# EAGLE board cbm2-8088 (EAGLE 5.11), part 1 of 2
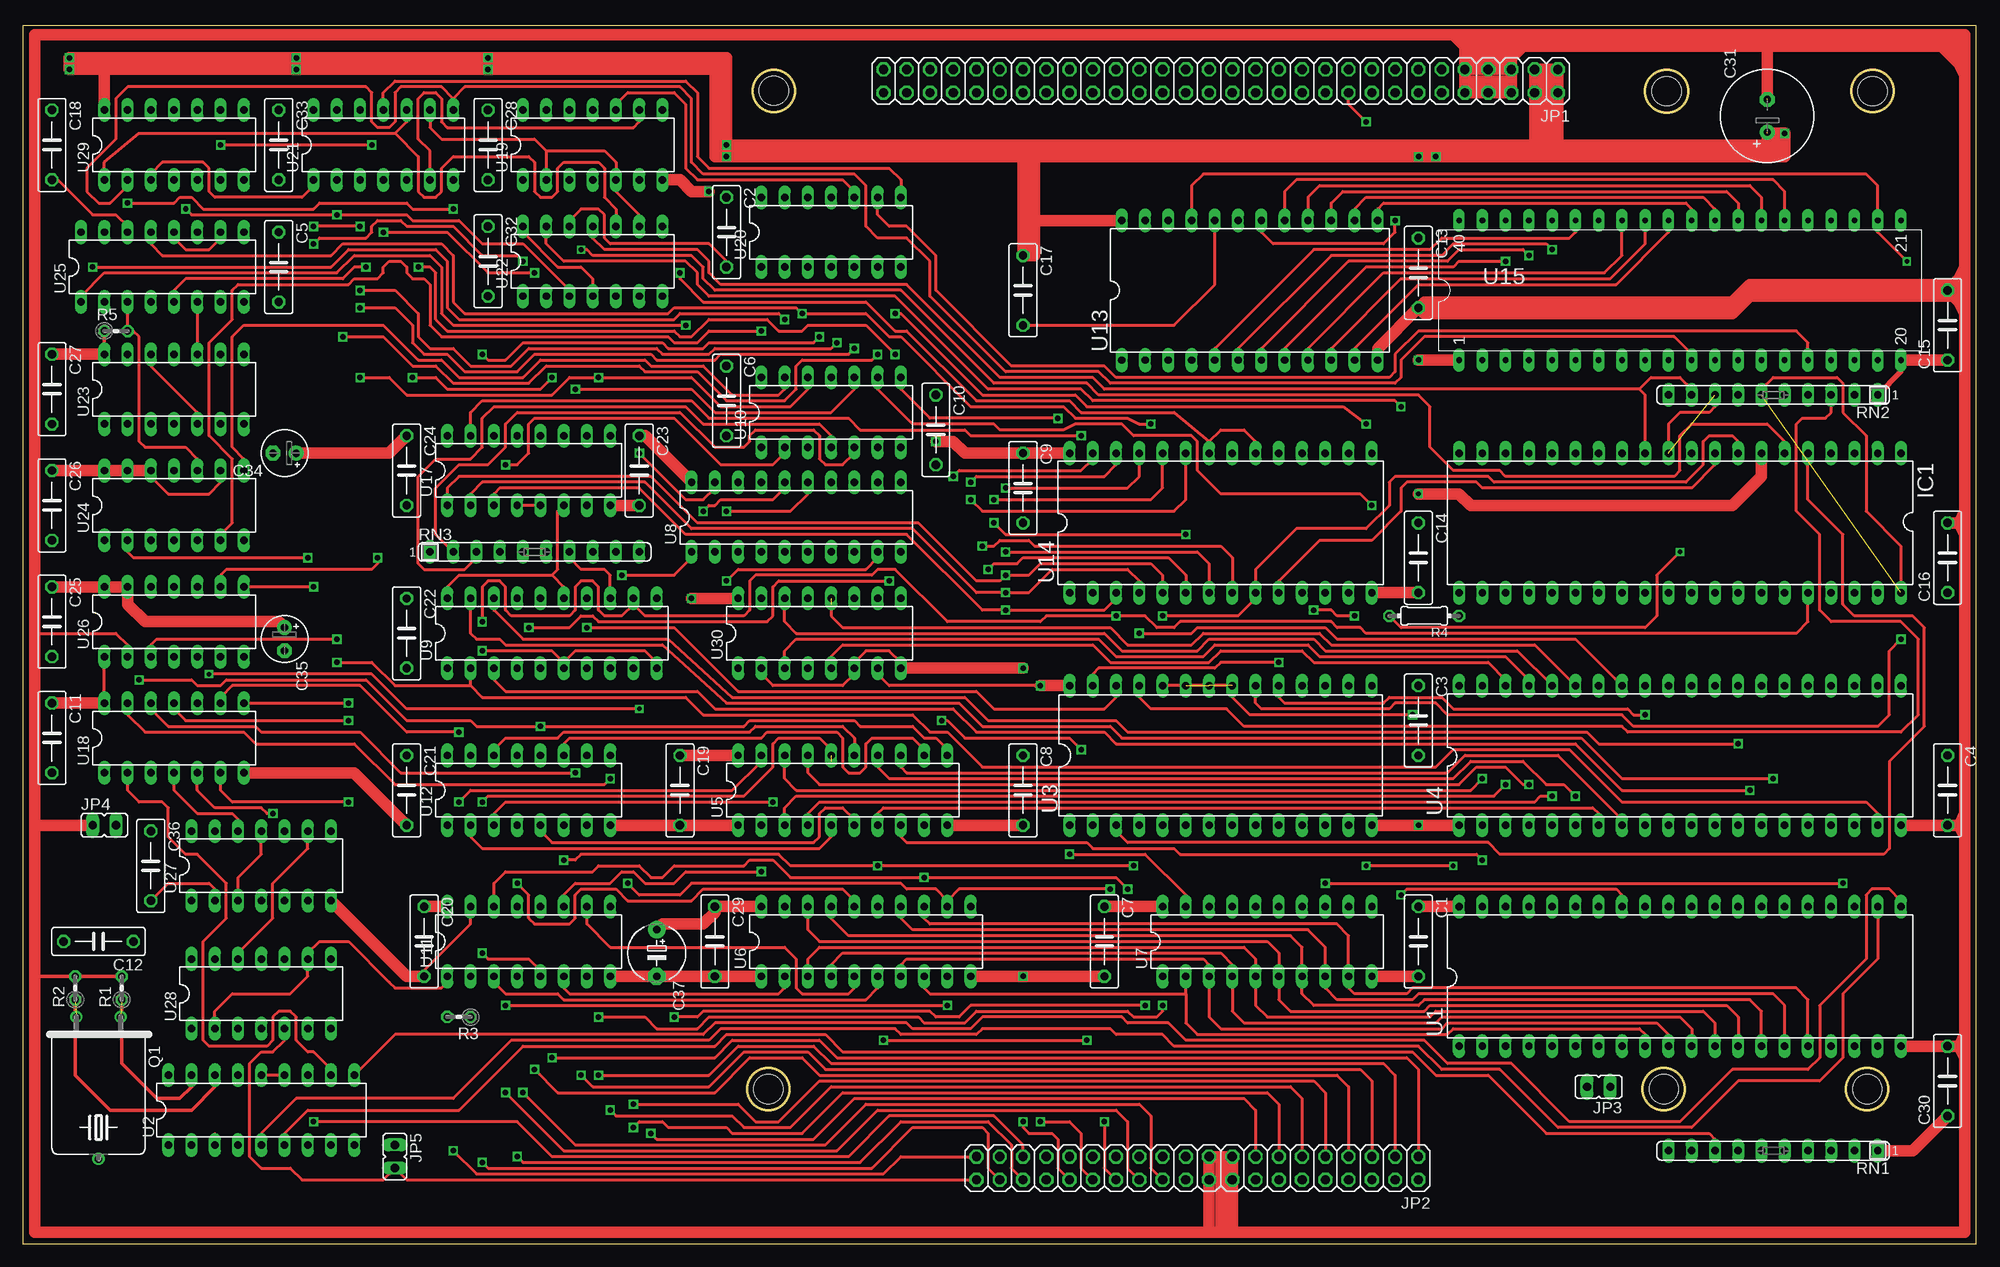
[diagram p2: board, top side]
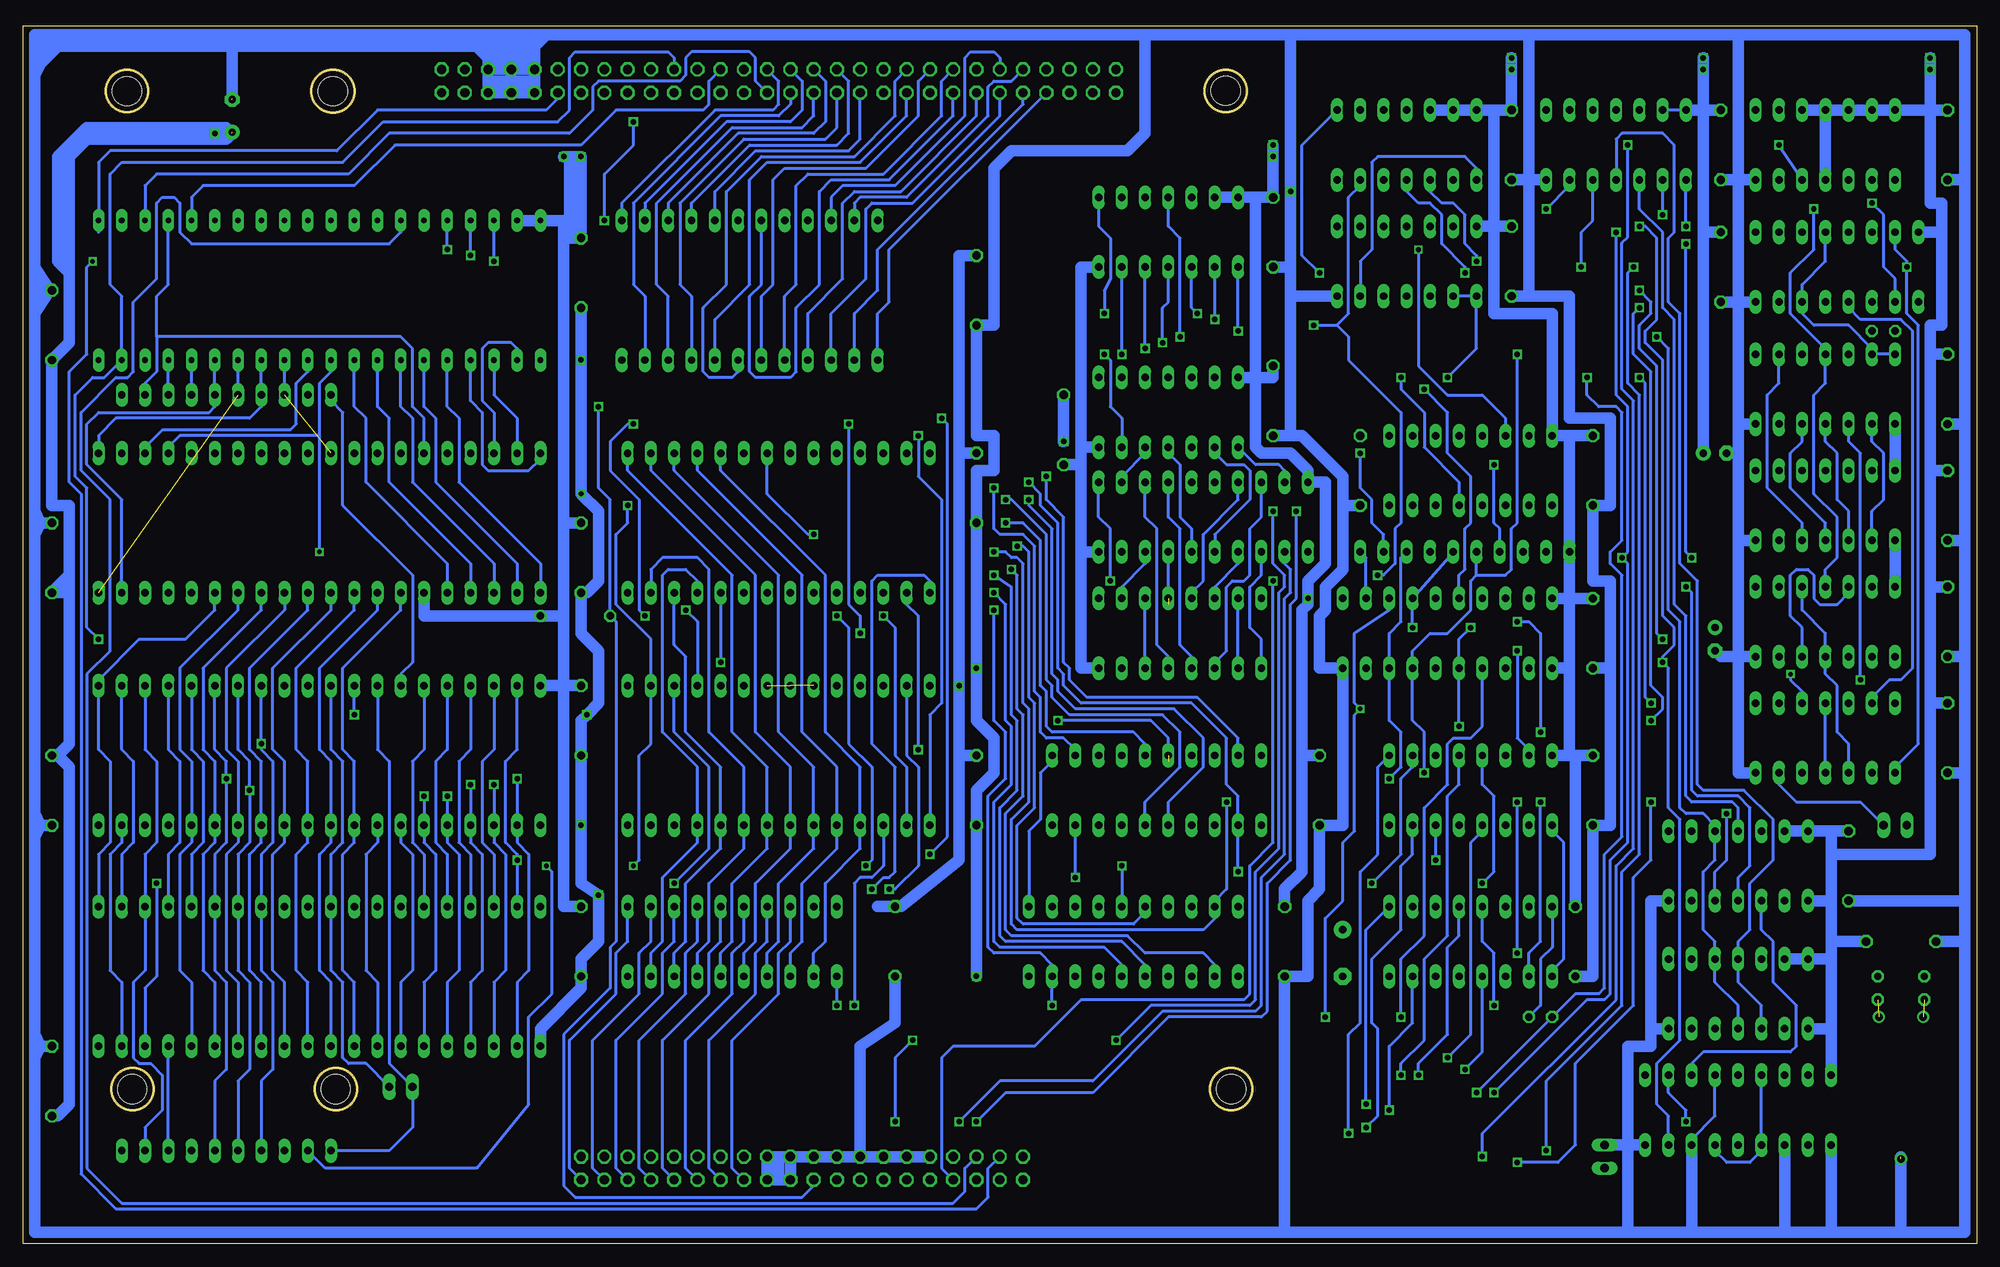
[diagram p3: board, bottom side, seen from below]

Size 213.34 x 133.02 mm. Coordinates in mm from the lower left corner, seen from the top.
Outline: 0,0 213.34,0 213.34,133.02 0,133.02 0,0
Outline: circle at 179.5,125.9 radius 2.33
Outline: circle at 202,125.9 radius 2.3
Outline: circle at 82,125.9 radius 2.3
Outline: circle at 81.4,16.9 radius 2.3
Outline: circle at 179.19,16.9 radius 2.3
Outline: circle at 201.41,16.9 radius 2.3
Copper layers (1*16): Top 0.035mm / dielectric 1.5mm / Bottom 0.035mm
Design rules "default *": minimum track width 10mil, minimum drill 24mil, track to track 8mil, track to pad 8mil, pad to pad 8mil, via to via 8mil, smd to smd 8mil, copper to edge 10mil, drill to drill 8mil, minimum pad ring 10mil, minimum via ring 8mil, stop-mask expansion 4mil, vias tented up to drill 0mil, thermal gap 10mil
Holes 3.2 mm at 82,125.93 81.4,16.9 179.5,125.9 202,125.9 179.19,16.9 201.41,16.9

## Footprints (pad centres in the part's own frame; a part is rotated, then mirrored left to right if it is on the bottom)
C075-032X103 = drill 0.914 octagon: 1 -3.81,0; 2 3.81,0
E3,5-10 = drill 0.813 pad 1.6 round: + -1.778,0 | drill 0.813 pad 1.6 octagon: - 1.778,0
E2,5-5 = drill 0.813 pad 1.6 round: + -1.27,0 | drill 0.813 pad 1.6 octagon: - 1.27,0
E5-6 = drill 0.813 pad 1.905 round: + -2.54,0 | drill 0.813 pad 1.905 octagon: - 2.54,0
DIL40 = drill 0.813 long: 1 -24.13,-7.62; 2 -21.59,-7.62; 3 -19.05,-7.62; 4 -16.51,-7.62; 5 -13.97,-7.62; 6 -11.43,-7.62; 7 -8.89,-7.62; 8 -6.35,-7.62; 9 -3.81,-7.62; 10 -1.27,-7.62; 11 1.27,-7.62; 12 3.81,-7.62; 13 6.35,-7.62; 14 8.89,-7.62; 15 11.43,-7.62; 16 13.97,-7.62; 17 16.51,-7.62; 18 19.05,-7.62; 19 21.59,-7.62; 20 24.13,-7.62; 21 24.13,7.62; 22 21.59,7.62; 23 19.05,7.62; 24 16.51,7.62; 25 13.97,7.62; 26 11.43,7.62; 27 8.89,7.62; 28 6.35,7.62; 29 3.81,7.62; 30 1.27,7.62; 31 -1.27,7.62; 32 -3.81,7.62; 33 -6.35,7.62; 34 -8.89,7.62; 35 -11.43,7.62; 36 -13.97,7.62; 37 -16.51,7.62; 38 -19.05,7.62; 39 -21.59,7.62; 40 -24.13,7.62
2X30 = drill 1.016 octagon: 1 -38.1,-1.27; 2 -38.1,1.27; 3 -35.56,-1.27; 4 -35.56,1.27; 5 -33.02,-1.27; 6 -33.02,1.27; 7 -30.48,-1.27; 8 -30.48,1.27; 9 -27.94,-1.27; 10 -27.94,1.27; 11 -25.4,-1.27; 12 -25.4,1.27; 13 -22.86,-1.27; 14 -22.86,1.27; 15 -20.32,-1.27; 16 -20.32,1.27; 17 -17.78,-1.27; 18 -17.78,1.27; 19 -15.24,-1.27; 20 -15.24,1.27; 21 -12.7,-1.27; 22 -12.7,1.27; 23 -10.16,-1.27; 24 -10.16,1.27; 25 -7.62,-1.27; 26 -7.62,1.27; 27 -5.08,-1.27; 28 -5.08,1.27; 29 -2.54,-1.27; 30 -2.54,1.27; 31 0,-1.27; 32 0,1.27; 33 2.54,-1.27; 34 2.54,1.27; 35 5.08,-1.27; 36 5.08,1.27; 37 7.62,-1.27; 38 7.62,1.27; 39 10.16,-1.27; 40 10.16,1.27; 41 12.7,-1.27; 42 12.7,1.27; 43 15.24,-1.27; 44 15.24,1.27; 45 17.78,-1.27; 46 17.78,1.27; 47 20.32,-1.27; 48 20.32,1.27; 49 22.86,-1.27; 50 22.86,1.27; 51 25.4,-1.27; 52 25.4,1.27; 53 27.94,-1.27; 54 27.94,1.27; 55 30.48,-1.27; 56 30.48,1.27; 57 33.02,-1.27; 58 33.02,1.27; 59 35.56,-1.27; 60 35.56,1.27
2X20 = drill 1.016 octagon: 1 -24.13,-1.27; 2 -24.13,1.27; 3 -21.59,-1.27; 4 -21.59,1.27; 5 -19.05,-1.27; 6 -19.05,1.27; 7 -16.51,-1.27; 8 -16.51,1.27; 9 -13.97,-1.27; 10 -13.97,1.27; 11 -11.43,-1.27; 12 -11.43,1.27; 13 -8.89,-1.27; 14 -8.89,1.27; 15 -6.35,-1.27; 16 -6.35,1.27; 17 -3.81,-1.27; 18 -3.81,1.27; 19 -1.27,-1.27; 20 -1.27,1.27; 21 1.27,-1.27; 22 1.27,1.27; 23 3.81,-1.27; 24 3.81,1.27; 25 6.35,-1.27; 26 6.35,1.27; 27 8.89,-1.27; 28 8.89,1.27; 29 11.43,-1.27; 30 11.43,1.27; 31 13.97,-1.27; 32 13.97,1.27; 33 16.51,-1.27; 34 16.51,1.27; 35 19.05,-1.27; 36 19.05,1.27; 37 21.59,-1.27; 38 21.59,1.27; 39 24.13,-1.27; 40 24.13,1.27
JP1 = drill 0.914 long: 1 0,-1.27; 2 0,1.27
HC49TL-H = drill 0.813 round: 1 -2.413,-7.62; 2 2.413,-7.62; 3 0,7.874
0204V = drill 0.813 octagon: 1 -1.27,0; 2 1.27,0
0204/7 = drill 0.813 octagon: 1 -3.81,0; 2 3.81,0
SIL10 = drill 0.813 long: 1 -11.43,0; 2 -8.89,0; 3 -6.35,0; 4 -3.81,0; 5 -1.27,0; 6 1.27,0; 7 3.81,0; 8 6.35,0; 9 8.89,0; 10 11.43,0
DIL18 = drill 0.813 long: 1 -10.16,-3.81; 2 -7.62,-3.81; 3 -5.08,-3.81; 4 -2.54,-3.81; 5 0,-3.81; 6 2.54,-3.81; 7 5.08,-3.81; 8 7.62,-3.81; 9 10.16,-3.81; 10 10.16,3.81; 11 7.62,3.81; 12 5.08,3.81; 13 2.54,3.81; 14 0,3.81; 15 -2.54,3.81; 16 -5.08,3.81; 17 -7.62,3.81; 18 -10.16,3.81
DIL28-6 = drill 0.813 long: 1 -16.51,-7.62; 2 -13.97,-7.62; 3 -11.43,-7.62; 4 -8.89,-7.62; 5 -6.35,-7.62; 6 -3.81,-7.62; 7 -1.27,-7.62; 8 1.27,-7.62; 9 3.81,-7.62; 10 6.35,-7.62; 11 8.89,-7.62; 12 11.43,-7.62; 13 13.97,-7.62; 14 16.51,-7.62; 15 16.51,7.62; 16 13.97,7.62; 17 11.43,7.62; 18 8.89,7.62; 19 6.35,7.62; 20 3.81,7.62; 21 1.27,7.62; 22 -1.27,7.62; 23 -3.81,7.62; 24 -6.35,7.62; 25 -8.89,7.62; 26 -11.43,7.62; 27 -13.97,7.62; 28 -16.51,7.62
DIL20 = drill 0.813 long: 1 -11.43,-3.81; 2 -8.89,-3.81; 3 -6.35,-3.81; 4 -3.81,-3.81; 5 -1.27,-3.81; 6 1.27,-3.81; 7 3.81,-3.81; 8 6.35,-3.81; 9 8.89,-3.81; 10 11.43,-3.81; 11 11.43,3.81; 12 8.89,3.81; 13 6.35,3.81; 14 3.81,3.81; 15 1.27,3.81; 16 -1.27,3.81; 17 -3.81,3.81; 18 -6.35,3.81; 19 -8.89,3.81; 20 -11.43,3.81
DIL14 = drill 0.813 long: 1 -7.62,-3.81; 2 -5.08,-3.81; 3 -2.54,-3.81; 4 0,-3.81; 5 2.54,-3.81; 6 5.08,-3.81; 7 7.62,-3.81; 8 7.62,3.81; 9 5.08,3.81; 10 2.54,3.81; 11 0,3.81; 12 -2.54,3.81; 13 -5.08,3.81; 14 -7.62,3.81
DIL16 = drill 0.813 long: 1 -8.89,-3.81; 2 -6.35,-3.81; 3 -3.81,-3.81; 4 -1.27,-3.81; 5 1.27,-3.81; 6 3.81,-3.81; 7 6.35,-3.81; 8 8.89,-3.81; 9 8.89,3.81; 10 6.35,3.81; 11 3.81,3.81; 12 1.27,3.81; 13 -1.27,3.81; 14 -3.81,3.81; 15 -6.35,3.81; 16 -8.89,3.81
DIL24 = drill 0.813 long: 1 -13.97,-7.62; 2 -11.43,-7.62; 3 -8.89,-7.62; 4 -6.35,-7.62; 5 -3.81,-7.62; 6 -1.27,-7.62; 7 1.27,-7.62; 8 3.81,-7.62; 9 6.35,-7.62; 10 8.89,-7.62; 11 11.43,-7.62; 12 13.97,-7.62; 13 13.97,7.62; 14 11.43,7.62; 15 8.89,7.62; 16 6.35,7.62; 17 3.81,7.62; 18 1.27,7.62; 19 -1.27,7.62; 20 -3.81,7.62; 21 -6.35,7.62; 22 -8.89,7.62; 23 -11.43,7.62; 24 -13.97,7.62
DIL28 = drill 0.813 long: 1 -16.51,-7.62; 2 -13.97,-7.62; 3 -11.43,-7.62; 4 -8.89,-7.62; 5 -6.35,-7.62; 6 -3.81,-7.62; 7 -1.27,-7.62; 8 1.27,-7.62; 9 3.81,-7.62; 10 6.35,-7.62; 11 8.89,-7.62; 12 11.43,-7.62; 13 13.97,-7.62; 14 16.51,-7.62; 15 16.51,7.62; 16 13.97,7.62; 17 11.43,7.62; 18 8.89,7.62; 19 6.35,7.62; 20 3.81,7.62; 21 1.27,7.62; 22 -1.27,7.62; 23 -3.81,7.62; 24 -6.35,7.62; 25 -8.89,7.62; 26 -11.43,7.62; 27 -13.97,7.62; 28 -16.51,7.62
DIP40 = drill 0.61 pad 1.27 long: 1 -24.13,-7.62; 2 -21.59,-7.62; 3 -19.05,-7.62; 4 -16.51,-7.62; 5 -13.97,-7.62; 6 -11.43,-7.62; 7 -8.89,-7.62; 8 -6.35,-7.62; 9 -3.81,-7.62; 10 -1.27,-7.62; 11 1.27,-7.62; 12 3.81,-7.62; 13 6.35,-7.62; 14 8.89,-7.62; 15 11.43,-7.62; 16 13.97,-7.62; 17 16.51,-7.62; 18 19.05,-7.62; 19 21.59,-7.62; 20 24.13,-7.62; 21 24.13,7.62; 22 21.59,7.62; 23 19.05,7.62; 24 16.51,7.62; 25 13.97,7.62; 26 11.43,7.62; 27 8.89,7.62; 28 6.35,7.62; 29 3.81,7.62; 30 1.27,7.62; 31 -1.27,7.62; 32 -3.81,7.62; 33 -6.35,7.62; 34 -8.89,7.62; 35 -11.43,7.62; 36 -13.97,7.62; 37 -16.51,7.62; 38 -19.05,7.62; 39 -21.59,7.62; 40 -24.13,7.62

## Placement (x,y rotation side)
C1  100n  [C075-032X103]  152.4,33.02 270 top
C2  100n  [C075-032X103]  76.83,110.49 270 top
C3  100n  [C075-032X103]  152.4,57.15 270 top
C4  100n  [C075-032X103]  210.19,49.53 270 top
C5  100n  [C075-032X103]  27.94,106.68 270 top
C6  100n  [C075-032X103]  76.83,92.08 270 top
C7  100n  [C075-032X103]  118.11,33.02 270 top
C8  100n  [C075-032X103]  109.22,49.53 270 top
C9  100n  [C075-032X103]  109.22,82.55 270 top
C10  100n  [C075-032X103]  99.69,88.9 270 top
C11  100n  [C075-032X103]  3.17,55.24 270 top
C12  100n  [C075-032X103]  8.26,33.02 180 top
C13  100n  [C075-032X103]  152.4,106.05 270 top
C14  100n  [C075-032X103]  152.4,74.93 270 top
C15  100n  [C075-032X103]  210.19,100.33 90 top
C16  100n  [C075-032X103]  210.19,74.93 90 top
C17  100n  [C075-032X103]  109.22,104.14 270 top
C18  100n  [C075-032X103]  3.17,120.02 270 top
C19  100n  [C075-032X103]  71.75,49.53 270 top
C20  100n  [C075-032X103]  43.81,33.02 270 top
C21  100n  [C075-032X103]  41.91,49.53 270 top
C22  100n  [C075-032X103]  41.91,66.67 270 top
C23  100n  [C075-032X103]  67.31,84.45 270 top
C24  100n  [C075-032X103]  41.91,84.45 270 top
C25  100n  [C075-032X103]  3.17,67.94 270 top
C26  100n  [C075-032X103]  3.17,80.64 270 top
C27  100n  [C075-032X103]  3.17,93.34 270 top
C28  100n  [C075-032X103]  50.8,120.02 270 top
C29  100n  [C075-032X103]  75.56,33.02 270 top
C30  100n  [C075-032X103]  210.19,17.78 90 top
C31  10u  [E3,5-10]  190.5,123.19 90 top
C32  100n  [C075-032X103]  50.8,107.31 270 top
C33  100n  [C075-032X103]  27.94,120.02 270 top
C34  [E2,5-5]  28.57,86.36 180 top
C35  [E2,5-5]  28.57,66.04 270 top
C36  100n  [C075-032X103]  13.97,41.27 270 top
C37  25u  [E5-6]  69.22,31.75 270 top
IC1  8255  [DIL40]  180.97,78.74 180 top
JP1  [2X30]  129.54,127 180 top
JP2  [2X20]  128.27,8.26 180 top
JP3  [JP1]  172.09,17.14 90 top
JP4  [JP1]  8.89,45.72 270 top
JP5  [JP1]  40.64,9.53 180 top
Q1  15 MHz  [HC49TL-H]  8.26,17.14 180 top
R1  510  [0204V]  10.79,27.94 90 top
R2  510  [0204V]  5.71,27.94 90 top
R3  4K7  [0204V]  47.62,24.77 180 top
R4  4K7  [0204/7]  153.03,68.58 180 top
R5  4K7  [0204V]  10.16,99.69 0 top
RN1  10K  [SIL10]  191.13,10.16 180 top
RN2  10K  [SIL10]  191.13,92.71 180 top
RN3  10K  [SIL10]  55.88,75.56 0 top
U1  8088MAX  [DIL40]  180.97,29.21 0 top
U2  8284-B  [DIL18]  26.04,14.61 0 top
U3  8259  [DIL28-6]  130.81,53.34 0 top
U4  8087  [DIL40]  180.97,53.34 0 top
U5  74LS373N  [DIL20]  89.53,49.53 0 top
U6  74LS373N  [DIL20]  92.08,33.02 0 top
U7  74LS245N  [DIL20]  135.89,33.02 0 top
U8  74LS373N  [DIL20]  84.45,79.38 0 top
U9  8288-A  [DIL20]  57.78,66.67 0 top
U10  74LS20N  [DIL14]  88.27,90.81 0 top
U11  74LS257N  [DIL16]  55.24,33.02 0 top
U12  74LS257N  [DIL16]  55.24,49.53 0 top
U13  6116  [DIL24]  133.99,104.14 0 top
U14  27512  [DIL28]  130.81,78.74 0 top
U15  6526  [DIP40]  180.97,104.14 0 top
U17  74LS138N  [DIL16]  55.24,84.45 0 top
U18  74LS08N  [DIL14]  16.51,55.24 0 top
U19  74LS00N  [DIL14]  62.23,120.02 0 top
U20  74LS04N  [DIL14]  88.27,110.49 0 top
U21  74LS04N  [DIL14]  39.37,120.02 0 top
U22  74LS74N  [DIL14]  62.23,107.31 0 top
U23  74LS74N  [DIL14]  16.51,93.34 0 top
U24  74LS86N  [DIL14]  16.51,80.64 0 top
U25  74367N  [DIL16]  15.24,106.68 0 top
U26  74LS74N  [DIL14]  16.51,67.94 0 top
U27  74LS74N  [DIL14]  26.04,41.27 0 top
U28  74LS74N  [DIL14]  26.04,27.3 0 top
U29  74LS74N  [DIL14]  16.51,120.02 0 top
U30  74LS283N  [DIL16]  87,66.67 0 top

## Tracks (layer width: path | path; a pad name or v marks a point on that pad's centre or on a via)
/CLK  (via drill 0.6)
  Top 0.305: U22.3 59.69,104.14 54.61,109.22 50.16,109.22 47.62,111.76 42.55,111.76 41.91,112.39 v34.29,112.39 18.41,112.39 v17.78,113.03
  Bottom 0.305: U26.11 16.51,73.66 15.24,74.93 15.24,79.38 17.78,81.92 17.78,92.71 16.51,93.98 U23.11 16.51,97.79 20.32,101.6 20.32,106.05 17.78,108.58 v17.78,113.03 | v34.29,112.39 U21.2
A0  (via drill 0.6)
  Top 0.305: U3.27 116.84,62.23 117.47,62.87 130.18,62.87 130.81,63.5 v137.16,63.5 | 100.97,37.47 U6.12 | 100.97,37.47 99.69,38.73 96.52,38.73 95.89,39.37 73.03,39.37 71.75,38.1 67.31,38.1 v66.04,39.37 | U14.10 137.16,72.39 141.6,76.83 147.32,76.83 150.5,80.01 150.5,82.55 151.13,83.19 158.75,83.19 159.38,82.55 182.25,82.55 184.78,85.09 IC1.9 | 100.97,37.47 102.23,38.73 v118.75,38.73
  Bottom 0.305: U14.10 v137.16,63.5 | U12.10 61.59,52.07 62.87,50.8 62.87,42.55 v66.04,39.37 | U3.27 116.84,53.34 115.57,52.07 115.57,41.27 118.11,38.73 v118.75,38.73
A1  (via drill 0.6)
  Top 0.305: v59.05,41.91 60.33,41.91 60.96,42.55 82.55,42.55 83.82,41.27 v93.34,41.27 v121.28,41.27 | v124.46,68.58 132.72,68.58 134.62,70.48 U14.9 134.62,73.66 139.06,78.11 146.69,78.11 149.22,80.64 149.22,83.19 149.86,83.82 160.02,83.82 160.66,83.19 181.61,83.19 183.51,85.09 183.51,87.63 184.15,88.27 186.69,88.27 187.32,87.63 IC1.8
  Bottom 0.305: v59.05,41.91 U12.6 | v93.34,41.27 U6.15 | v124.46,68.58 123.19,67.31 123.19,54.61 120.65,52.07 120.65,41.91 v121.28,41.27
A2  (via drill 0.6)
  Top 0.305: U6.16 90.81,37.47 89.53,38.73 74.3,38.73 73.03,37.47 66.04,37.47 64.77,38.73 60.96,38.73 60.33,38.1 60.33,35.56 59.69,34.92 55.88,34.92 55.24,35.56 55.24,38.1 v53.98,39.37 | U14.8 132.08,74.93 130.81,76.2 110.49,76.2 109.86,76.83 106.68,76.83 106.05,76.2 v104.78,76.2
  Bottom 0.305: U12.13 53.98,50.16 52.7,48.9 52.7,40.64 v53.98,39.37 | U6.16 90.81,36.2 92.08,34.92 104.14,34.92 104.78,35.56 104.78,45.72 102.87,47.62 102.87,59.05 103.5,59.69 103.5,75.56 104.14,76.2 v104.78,76.2
A3  (via drill 0.6)
  Top 0.305: v107.31,75.56 128.27,75.56 129.54,74.3 U14.7 | U12.3 51.44,46.99 52.7,48.26 v81.92,48.26
  Bottom 0.305: v107.31,75.56 106.05,75.56 105.41,74.93 104.78,74.93 104.14,74.3 104.14,59.05 103.5,58.42 103.5,48.26 105.41,46.35 105.41,34.92 104.78,34.29 84.45,34.29 83.19,35.56 U6.19 83.19,37.47 81.92,38.73 v81.92,48.26
A4  (via drill 0.6)
  Top 0.305: U11.6 59.05,27.94 59.69,27.3 82.55,27.3 83.19,27.94 U6.2 | U14.6 127,73.03 125.09,74.93 109.22,74.93 108.58,74.3 106.05,74.3 v105.41,73.66
  Bottom 0.305: U6.2 83.19,30.48 84.45,31.75 90.81,31.75 92.71,33.66 105.41,33.66 106.05,34.29 106.05,46.99 104.14,48.9 104.14,57.78 104.78,58.42 104.78,73.03 v105.41,73.66
A5  (via drill 0.6)
  Top 0.305: U11.10 61.59,34.92 64.14,32.38 83.19,32.38 84.45,31.11 84.45,27.94 85.09,27.3 90.17,27.3 90.81,27.94 U6.5 | U14.5 124.46,73.03 123.19,74.3 111.12,74.3 109.86,73.03 v107.31,73.03 106.68,72.39 104.14,72.39 97.79,78.74 73.66,78.74 68.58,83.82 47.62,83.82 46.35,82.55 U17.1
  Bottom 0.305: U6.5 90.81,30.48 93.34,33.02 106.05,33.02 106.68,33.66 106.68,47.62 104.78,49.53 104.78,57.15 105.41,57.78 105.41,71.75 v107.31,73.03
A6  (via drill 0.6)
  Top 0.305: U11.3 51.44,28.57 52.7,27.3 58.42,27.3 59.05,26.67 92.08,26.67 93.34,27.94 U6.6 | U14.4 121.92,72.39 120.65,73.66 112.39,73.66 109.86,71.12 v107.31,71.12 104.14,71.12 97.16,78.11 73.03,78.11 67.94,83.19 50.16,83.19 48.9,81.92 U17.2
  Bottom 0.305: U6.6 93.34,30.48 95.25,32.38 106.68,32.38 107.31,33.02 107.31,48.26 105.41,50.16 105.41,56.52 106.05,57.15 106.05,69.85 v107.31,71.12
A7  (via drill 0.6)
  Top 0.305: v52.7,26.04 v100.97,26.04 | U14.3 119.38,70.48 118.11,69.22 v107.31,69.22 104.78,69.22 96.52,77.47 72.39,77.47 67.31,82.55 52.07,82.55 51.44,81.92 U17.3
  Bottom 0.305: U11.13 53.98,33.02 52.7,31.75 v52.7,26.04 | v100.97,26.04 U6.9 100.97,30.48 102.23,31.75 107.31,31.75 107.95,32.38 107.95,48.9 106.05,50.8 106.05,55.88 107.31,57.15 v107.31,69.22
A8  (via drill 0.6)
  Top 0.305: U5.12 98.42,53.98 97.16,55.24 92.71,55.24 92.08,54.61 92.08,52.07 91.44,51.44 90.17,51.44 89.53,52.07 89.53,55.24 88.9,55.88 81.28,55.88 80.64,55.24 59.69,55.24 59.05,54.61 U12.11 | v107.31,82.55 120.65,82.55 121.92,83.82 U14.25
  Bottom 0.305: U5.12 98.42,53.98 99.69,55.24 101.6,55.24 102.23,55.88 102.23,59.69 102.87,60.33 102.87,76.2 104.14,77.47 106.68,77.47 107.31,78.11 v107.31,82.55
A9  (via drill 0.6)
  Top 0.305: U5.6 90.81,46.35 89.53,47.62 87.63,47.62 87,46.99 87,44.45 86.36,43.81 57.78,43.81 56.52,45.09 U12.5 | v106.05,81.28 123.19,81.28 124.46,82.55 U14.24
  Bottom 0.305: U5.6 90.81,48.26 87,52.07 87,55.88 88.9,57.78 99.06,57.78 100.97,59.69 100.97,60.96 101.6,61.59 101.6,77.47 105.41,81.28 v106.05,81.28
A10  (via drill 0.6)
  Top 0.305: U12.14 51.44,53.98 52.7,55.24 58.42,55.24 59.05,55.88 79.38,55.88 80.01,56.52 89.53,56.52 90.81,55.24 U5.15 | v106.05,78.74 107.31,77.47 v127,77.47
  Bottom 0.305: U5.15 90.81,54.61 92.08,55.88 100.97,55.88 101.6,56.52 101.6,60.33 102.23,60.96 102.23,76.83 104.14,78.74 v106.05,78.74 | U14.21 132.08,81.92 127.64,77.47 v127,77.47
A11  (via drill 0.6)
  Top 0.305: U12.2 48.9,44.45 50.16,43.18 87,43.18 88.27,44.45 U5.5 | v103.5,81.28 104.78,80.01 125.73,80.01 127,81.28 U14.23
  Bottom 0.305: U5.5 88.27,48.26 84.45,52.07 84.45,55.24 87.63,58.42 98.42,58.42 100.33,60.33 100.33,61.59 100.97,62.23 100.97,78.11 103.5,80.64 v103.5,81.28
A12  (via drill 0.6)  (1 unrouted)
  Top 0.305: U5.16 88.27,53.98 87,55.24 82.55,55.24 81.92,54.61 81.92,52.07 78.74,48.9 50.8,48.9 v50.16,48.26 | U11.5 56.52,29.84 55.24,31.11 50.8,31.11 v50.16,31.75 | v100.33,57.15 100.97,57.15 102.87,55.24 114.3,55.24 v115.57,53.98
  Bottom 0.305: v50.16,31.75 v50.16,48.26 | U14.2 116.84,69.85 115.57,68.58 v115.57,53.98 | 88.27,52.7 88.27,55.24 90.17,57.15 v100.33,57.15
A13  (via drill 0.6)
  Top 0.305: U11.11 59.05,38.1 60.33,39.37 64.14,39.37 65.41,40.64 66.67,40.64 67.94,39.37 71.12,39.37 72.39,40.64 v80.64,40.64 | U14.26 119.38,85.09 118.11,83.82 104.14,83.82 v103.5,83.19
  Bottom 0.305: v80.64,40.64 U5.2 80.64,48.9 81.92,50.16 81.92,55.24 85.72,59.05 97.79,59.05 99.69,60.96 99.69,62.23 100.33,62.87 100.33,78.74 102.23,80.64 102.23,81.92 v103.5,83.19
A14  (via drill 0.6)
  Top 0.305: U5.19 80.64,52.7 77.47,49.53 48.9,49.53 v47.62,48.26 | U14.27 116.84,85.72 115.57,84.45 102.23,84.45 v101.6,83.82
  Bottom 0.305: U11.2 48.9,31.75 47.62,33.02 v47.62,48.26 | U5.19 80.64,55.24 85.09,59.69 97.16,59.69 99.06,61.59 99.06,62.87 99.69,63.5 99.69,79.38 101.6,81.28 v101.6,83.82
A15  (via drill 0.6)
  Top 0.305: U11.14 51.44,39.37 52.7,40.64 62.23,40.64 62.87,41.27 67.31,41.27 68.58,40.01 69.85,40.01 71.12,41.27 78.74,41.27 79.38,41.91 81.92,41.91 83.82,40.01 v98.42,40.01 119.38,40.01 v120.65,38.73
  Bottom 0.305: v98.42,40.01 U5.9 | U14.1 114.3,72.39 114.94,73.03 120.02,73.03 120.65,72.39 120.65,54.61 118.11,52.07 118.11,40.64 118.75,40.01 119.38,40.01 v120.65,38.73
AA8
  Top 0.305: U5.13 95.89,52.07 96.52,51.44 155.57,51.44 157.48,53.34 167.64,53.34 174.62,46.35 U4.8
  Bottom 0.305: U1.8 174.62,28.57 175.9,29.84 175.9,42.55 174.62,43.81 U4.8
AA9
  Top 0.305: U5.7 93.34,46.99 93.98,47.62 171.45,47.62 172.09,46.99 U4.7
  Bottom 0.305: U4.7 172.09,43.81 170.81,42.55 170.81,29.84 172.09,28.57 U1.7
AA10  (via drill 0.6)
  Top 0.305: U5.14 93.34,52.07 94.61,50.8 156.21,50.8 158.12,52.7 163.83,52.7 166.37,50.16 168.28,50.16 v169.54,48.9
  Bottom 0.305: U1.6 169.54,28.57 168.28,29.84 168.28,42.55 169.54,43.81 U4.6 v169.54,48.9
AA11  (via drill 0.6)
  Top 0.305: U5.4 85.72,46.99 87,48.26 165.1,48.26 165.74,48.9 v167,48.9
  Bottom 0.305: U1.5 167,28.57 165.74,29.84 165.74,42.55 167,43.81 U4.5 v167,48.9
AA12  (via drill 0.6)
  Top 0.305: U5.17 85.72,51.44 87,50.16 156.84,50.16 158.75,52.07 161.93,52.07 163.83,50.16 v164.47,50.16
  Bottom 0.305: U1.4 164.47,28.57 163.19,29.84 163.19,42.55 164.47,43.81 U4.4 v164.47,50.16
AA13  (via drill 0.6)
  Top 0.305: U5.3 83.19,47.62 84.45,48.9 160.66,48.9 v161.93,50.16
  Bottom 0.305: U1.3 161.93,28.57 160.66,29.84 160.66,42.55 161.93,43.81 U4.3 v161.93,50.16
AA14  (via drill 0.6)
  Top 0.305: U5.18 83.19,50.8 84.45,49.53 158.12,49.53 v159.38,50.8
  Bottom 0.305: U1.2 159.38,28.57 158.12,29.84 158.12,42.55 159.38,43.81 U4.2 v159.38,50.8
AA15  (via drill 0.6)
  Top 0.305: U5.8 95.89,44.45 96.52,43.81 116.2,43.81 116.84,43.18 125.73,43.18 126.36,42.55 158.75,42.55 v159.38,41.91
  Bottom 0.305: U1.39 v159.38,41.91 159.38,42.55 160.66,43.81 160.66,52.7 159.38,53.98 U4.39
AA16
  Top 0.305: U4.38 161.93,61.59 160.02,63.5 140.97,63.5 139.7,64.77 130.81,64.77 129.54,63.5 118.75,63.5 116.84,65.41 89.53,65.41 88.27,64.14 U30.5
  Bottom 0.305: U4.38 161.93,53.98 163.19,52.7 163.19,43.81 161.93,42.55 U1.38 | U8.13 90.81,79.38 89.53,78.11 89.53,65.41 88.27,64.14 U30.5
AA17
  Top 0.305: U4.37 164.47,61.59 161.93,64.14 141.6,64.14 140.34,65.41 130.18,65.41 128.91,64.14 119.38,64.14 117.47,66.04 84.45,66.04 83.19,64.77 U30.3
  Bottom 0.305: U1.37 164.47,42.55 165.74,43.81 165.74,52.7 164.47,53.98 U4.37 | U8.18 78.11,79.38 79.38,78.11 79.38,73.03 80.01,72.39 81.28,72.39 81.92,71.75 81.92,64.77 83.19,63.5 U30.3
AA18
  Top 0.305: U4.36 163.19,64.77 142.24,64.77 140.97,66.04 129.54,66.04 128.27,64.77 120.02,64.77 118.11,66.67 84.45,66.67 83.19,67.94 U30.14
  Bottom 0.305: U1.36 167,42.55 168.28,43.81 168.28,52.7 167,53.98 U4.36 | U8.4 80.64,74.3 83.19,71.75 U30.14
AA19  (1 unrouted)
  Top 0.305: U4.35 165.1,65.41 142.88,65.41 141.6,66.67 128.91,66.67 127.64,65.41 120.65,65.41 118.75,67.31 89.53,67.31 88.27,68.58 U30.12
  Bottom 0.305: U4.35 169.54,53.98 170.81,52.7 170.81,43.81 169.54,42.55 U1.35 | 88.27,69.85 U8.7
AB0  (via drill 0.6)
  Top 0.305: U13.8 137.79,97.79 146.69,106.68 156.21,106.68 156.84,107.31 v161.93,107.31
  Bottom 0.305: JP1.42 116.84,123.19 121.92,118.11 132.08,118.11 133.99,116.2 133.99,104.78 137.79,100.97 U13.8 | v161.93,107.31 U15.38
AB1  (via drill 0.6)
  Top 0.305: U13.7 135.25,97.79 144.78,107.31 155.57,107.31 156.84,108.58 163.83,108.58 v164.47,107.95
  Bottom 0.305: JP1.41 118.11,127 118.11,123.19 122.56,118.75 132.72,118.75 136.53,114.94 136.53,104.78 139.06,102.23 139.06,95.25 138.43,94.61 135.89,94.61 135.25,95.25 U13.7 | v164.47,107.95 U15.37
AB2  (via drill 0.6)
  Top 0.305: U13.6 132.72,97.79 142.88,107.95 154.94,107.95 156.21,109.22 166.37,109.22 v167,108.58
  Bottom 0.305: JP1.43 115.57,127 115.57,123.19 121.28,117.47 130.18,117.47 131.44,116.2 131.44,104.78 132.72,103.5 U13.6 | v167,108.58 U15.36
AB3
  Top 0.305: U15.35 169.54,110.49 168.91,109.86 154.94,109.86 153.67,108.58 140.97,108.58 130.18,97.79 U13.5
  Bottom 0.305: JP1.45 113.03,127 113.03,123.19 119.38,116.84 127.64,116.84 128.91,115.57 128.91,104.78 130.18,103.5 U13.5
AB4
  Bottom 0.305: JP1.48 109.22,123.19 117.47,114.94 122.56,114.94 123.83,113.67 123.83,105.41 127.64,101.6 U13.4
AB5
  Bottom 0.305: JP1.50 106.68,123.19 116.2,113.67 120.65,113.67 121.28,113.03 121.28,105.41 125.09,101.6 U13.3
AB6
  Bottom 0.305: JP1.52 104.14,124.46 120.02,108.58 120.02,104.14 122.56,101.6 U13.2
AB7
  Bottom 0.305: JP1.54 118.75,108.58 118.75,102.87 120.02,101.6 U13.1
AB8
  Bottom 0.305: JP1.51 105.41,127 107.31,127 107.95,126.36 107.95,123.19 116.84,114.3 121.92,114.3 122.56,113.67 U13.23
AB9
  Bottom 0.305: JP1.49 106.68,129.54 107.31,130.18 109.86,130.18 110.49,129.54 110.49,123.19 118.11,115.57 123.83,115.57 125.09,114.3 U13.22
AB10
  Bottom 0.305: JP1.46 111.76,123.19 118.75,116.2 125.09,116.2 126.36,114.94 126.36,104.78 128.91,102.23 128.91,95.25 129.54,94.61 133.35,94.61 133.99,95.25 133.99,103.5 132.72,104.78 U13.19
AD0
  Top 0.305: U1.16 194.94,26.67 193.68,27.94 151.76,27.94 151.13,27.3 145.41,27.3 144.78,27.94 U7.9 144.78,33.66 143.51,34.92 99.06,34.92 98.42,35.56 U6.13
  Bottom 0.305: U1.16 194.94,28.57 196.22,29.84 196.22,42.55 194.94,43.81 U4.16 194.94,52.7 196.22,53.98 196.22,62.87 189.87,69.22 IC1.34 | U7.9 144.78,31.75 143.51,33.02 143.51,40.01 139.7,43.81 U3.11 139.7,52.07 143.51,55.88 143.51,73.03 142.88,73.66 140.97,73.66 139.7,72.39 U14.11
AD1
  Top 0.305: U1.15 192.41,26.04 191.13,27.3 152.4,27.3 151.76,26.67 143.51,26.67 142.24,27.94 U7.8 142.24,32.38 140.34,34.29 97.16,34.29 95.89,35.56 U6.14
  Bottom 0.305: U1.15 192.41,28.57 193.68,29.84 193.68,42.55 192.41,43.81 U4.15 192.41,52.7 193.68,53.98 193.68,62.87 187.32,69.22 IC1.33 | U7.8 142.24,31.75 140.97,33.02 140.97,39.37 137.16,43.18 U3.10 137.16,52.07 140.97,55.88 140.97,64.14 142.24,65.41 U14.12
AD2
  Top 0.305: U1.14 189.87,25.4 188.59,26.67 153.03,26.67 152.4,26.04 140.97,26.04 139.7,27.3 U7.7 139.7,32.38 138.43,33.66 90.17,33.66 88.27,35.56 U6.17
  Bottom 0.305: U1.14 189.87,28.57 191.13,29.84 191.13,42.55 189.87,43.81 U4.14 189.87,52.7 191.13,53.98 191.13,62.87 184.78,69.22 IC1.32 | U7.7 139.7,31.75 138.43,33.02 138.43,39.37 134.62,43.18 U3.9 134.62,52.07 138.43,55.88 138.43,73.66 139.7,74.93 143.51,74.93 144.78,73.66 U14.13
AD3
  Top 0.305: U1.13 187.32,24.77 186.06,26.04 153.67,26.04 153.03,25.4 138.43,25.4 137.16,26.67 U7.6 137.16,31.75 135.89,33.02 87,33.02 85.72,34.29 U6.18
  Bottom 0.305: U1.13 187.32,28.57 188.59,29.84 188.59,42.55 187.32,43.81 U4.13 187.32,52.7 188.59,53.98 188.59,62.87 182.25,69.22 IC1.31 | U7.6 137.16,31.75 135.89,33.02 135.89,39.37 132.08,43.18 U3.8 132.08,52.07 135.89,55.88 135.89,73.03 147.32,84.45 U14.15
AD4
  Top 0.305: U1.12 184.78,24.13 183.51,25.4 154.31,25.4 153.67,24.77 135.89,24.77 134.62,26.04 U7.5 134.62,31.11 133.35,32.38 87,32.38 85.72,31.11 U6.3
  Bottom 0.305: U1.12 184.78,28.57 186.06,29.84 186.06,42.55 184.78,43.81 U4.12 184.78,52.7 186.06,53.98 186.06,62.87 179.71,69.22 IC1.30 | U7.5 134.62,31.75 133.35,33.02 133.35,39.37 129.54,43.18 U3.7 129.54,52.07 133.35,55.88 133.35,73.03 144.78,84.45 U14.16
AD5
  Top 0.305: U1.11 182.25,23.5 180.97,24.77 154.94,24.77 154.31,24.13 133.35,24.13 132.08,25.4 U7.4 132.08,30.48 130.81,31.75 89.53,31.75 88.27,30.48 U6.4
  Bottom 0.305: U1.11 182.25,28.57 183.51,29.84 183.51,42.55 182.25,43.81 U4.11 182.25,52.7 183.51,53.98 183.51,62.87 177.16,69.22 IC1.29 | U7.4 132.08,31.75 130.81,33.02 130.81,39.37 127,43.18 U3.6 127,52.07 130.81,55.88 130.81,73.03 142.24,84.45 U14.17
AD6
  Top 0.305: U1.10 179.71,22.86 178.44,24.13 155.57,24.13 154.94,23.5 130.81,23.5 129.54,24.77 U7.3 129.54,30.48 128.91,31.11 96.52,31.11 95.89,30.48 U6.7
  Bottom 0.305: U1.10 179.71,28.57 180.97,29.84 180.97,42.55 179.71,43.81 U4.10 179.71,52.7 180.97,53.98 180.97,62.87 174.62,69.22 IC1.28 | U7.3 129.54,31.75 128.27,33.02 128.27,39.37 124.46,43.18 U3.5 124.46,52.07 128.27,55.88 128.27,73.03 139.7,84.45 U14.18
AD7
  Top 0.305: 127,27.3 127,24.13 128.27,22.86 155.57,22.86 156.21,23.5 176.53,23.5 177.16,22.86 U1.9 | 127,27.3 U7.2 | U6.8 98.42,27.94 99.06,27.3 127,27.3
  Bottom 0.305: U1.9 177.16,28.57 178.44,29.84 178.44,42.55 177.16,43.81 U4.9 177.16,52.7 178.44,53.98 178.44,62.87 172.09,69.22 IC1.27 | U7.2 127,31.75 125.73,33.02 125.73,39.37 121.92,43.18 U3.4 121.92,52.07 125.73,55.88 125.73,73.03 137.16,84.45 U14.19
ALE  (via drill 0.6)
  Top 0.305: U5.11 100.97,53.98 99.69,55.24 98.42,55.24 97.16,56.52 91.44,56.52 90.81,57.15 79.38,57.15 78.74,56.52 v56.52,56.52 49.53,56.52 48.9,57.15 41.91,57.15 37.47,61.59 22.23,61.59 21.59,60.96 19.05,60.96 18.41,61.59 v12.7,61.59 | v94.61,72.39 82.55,72.39 81.92,71.75 81.92,68.58 81.28,67.94 62.87,67.94 62.23,68.58 60.96,68.58 59.69,67.31 v55.24,67.31
  Bottom 0.305: U5.11 100.97,52.7 102.23,51.44 102.23,46.35 103.5,45.09 U6.11 | v56.52,56.52 U9.5 56.52,66.04 v55.24,67.31 | U8.11 95.89,79.38 94.61,78.11 v94.61,72.39 | U23.3 13.97,87.63 12.7,86.36 v12.7,61.59
AMWC  (via drill 0.6)
  Top 0.305: v64.14,50.8 63.5,50.16 40.64,50.16 36.2,54.61 25.4,54.61 24.13,55.88 13.34,55.88 11.43,57.78 U18.13
  Bottom 0.305: RN3.8 62.87,74.93 62.87,67.94 64.14,66.67 U9.8 64.14,57.15 62.87,55.88 62.87,52.07 v64.14,50.8 | U18.13 11.43,59.69 9.53,61.59 8.26,61.59 6.99,62.87 6.99,99.69 8.26,100.97 12.7,100.97 13.97,102.23 U25.4
BD0
  Top 0.305: U13.9 140.34,97.79 148.59,106.05 172.72,106.05 174.62,107.95 U15.33
  Bottom 0.305: U13.9 140.34,103.5 141.6,104.78 141.6,113.67 134.62,120.65 125.73,120.65 124.46,121.92 JP1.36
BD1
  Top 0.305: U13.10 142.88,97.79 150.5,105.41 173.35,105.41 177.16,109.22 U15.32
  Bottom 0.305: U13.10 142.88,103.5 144.15,104.78 144.15,113.67 135.89,121.92 128.27,121.92 127,123.19 JP1.34
BD2
  Top 0.305: U13.11 145.41,97.79 152.4,104.78 173.99,104.78 179.71,110.49 U15.31
  Bottom 0.305: U13.11 145.41,103.5 146.69,104.78 146.69,113.67 137.16,123.19 130.81,123.19 129.54,124.46 JP1.32
BD3
  Top 0.305: U13.13 147.96,113.03 148.59,113.67 181.61,113.67 182.25,113.03 U15.30
  Bottom 0.305: JP1.29 130.81,127 130.81,124.46 131.44,123.83 137.79,123.83 147.96,113.67 U13.13
BD4
  Top 0.305: U13.14 145.41,113.03 146.69,114.3 183.51,114.3 184.78,113.03 U15.29
  Bottom 0.305: U13.14 145.41,113.67 136.53,122.56 129.54,122.56 128.27,123.83 128.27,127 JP1.31
BD5
  Top 0.305: U13.15 142.88,113.67 144.15,114.94 186.06,114.94 187.32,113.67 U15.28
  Bottom 0.305: U13.15 142.88,113.67 135.25,121.28 127,121.28 125.73,122.56 125.73,127 JP1.33
BD6
  Top 0.305: U15.27 189.87,114.3 188.59,115.57 141.6,115.57 140.34,114.3 U13.16
  Bottom 0.305: U13.16 140.34,113.67 133.99,120.02 124.46,120.02 123.19,121.28 123.19,127 JP1.35
BD7
  Top 0.305: U13.17 137.79,114.94 139.06,116.2 191.13,116.2 192.41,114.94 U15.26
  Bottom 0.305: JP1.38 121.92,120.65 123.19,119.38 133.35,119.38 137.79,114.94 U13.17
BP0  (via drill 0.6)
  Top 0.305: U8.15 85.72,81.92 83.82,80.01 v76.83,80.01 | JP2.28 118.11,8.26 v118.11,13.34 | v93.98,22.23 v116.2,22.23
  Bottom 0.305: v76.83,80.01 76.83,74.3 75.56,73.03 75.56,71.75 76.2,71.12 76.2,43.18 78.74,40.64 78.74,26.67 79.38,26.04 90.17,26.04 v93.98,22.23 | v116.2,22.23 118.11,20.32 v118.11,13.34
BP1  (via drill 0.6)
  Top 0.305: JP2.30 115.57,8.26 115.57,12.06 114.3,13.34 v111.12,13.34
  Bottom 0.305: U8.2 75.56,74.3 74.93,73.66 74.93,71.12 75.56,70.48 75.56,42.55 78.11,40.01 78.11,26.04 78.74,25.4 88.9,25.4 96.52,17.78 106.68,17.78 v111.12,13.34
BP2  (via drill 0.6)
  Top 0.305: U8.16 83.19,82.55 81.92,81.28 76.2,81.28 75.56,80.64 74.93,80.64 v74.3,80.01 | v109.22,13.34 109.22,12.7 109.86,12.06 112.39,12.06 113.03,11.43 113.03,8.26 JP2.32
  Bottom 0.305: v74.3,80.01 74.3,70.48 74.93,69.85 74.93,41.91 77.47,39.37 77.47,25.4 78.11,24.77 88.27,24.77 96.52,16.51 106.05,16.51 v109.22,13.34
BP3  (via drill 0.6)
  Top 0.305: v76.83,72.39 78.11,73.66 92.08,73.66 93.34,74.93 U8.9
  Bottom 0.305: v76.83,72.39 76.83,43.81 79.38,41.27 79.38,27.3 80.01,26.67 97.79,26.67 102.87,21.59 111.76,21.59 113.03,20.32 113.03,8.26 JP2.34
BUSY1  (via drill 0.5, 0.6)
  Top 0.305: R4.2 150.5,67.31 177.16,67.31 178.44,68.58 178.44,73.03 v180.97,75.56 | v150.5,91.44 149.86,92.08 116.84,92.08 115.57,93.34 105.41,93.34 95.25,103.5 74.93,103.5 73.66,104.78 73.66,106.05 72.39,107.31 59.05,107.31 57.15,109.22 U22.13
  Bottom 0.305: U15.10 179.71,95.25 180.97,93.98 180.97,88.27 | JP2.22 127,6.35 128.27,5.08 153.03,5.08 154.31,6.35 154.31,22.86 149.22,27.94 149.22,32.38 148.59,33.02 148.59,67.94 R4.2 149.22,81.28 150.5,82.55 v150.5,91.44 | v180.97,75.56 180.97,88.27 | 180.97,88.27 196.22,88.27 197.49,87 IC1.4
BUSY2  (via drill 0.6)
  Top 0.305: JP2.36 107.95,8.26 107.95,10.79 105.41,13.34 95.89,13.34 91.44,8.89 54.61,8.89 v53.98,9.53 | v38.1,120.02 v21.59,120.02
  Bottom 0.305: v38.1,120.02 38.1,109.97 38.73,109.33 38.73,93.34 37.47,92.08 37.47,43.18 39.37,41.27 39.37,26.67 53.98,12.06 v53.98,9.53 | v21.59,120.02 U29.5
CAS
  Top 0.305: JP2.40 41.91,6.99 JP5.2 39.37,6.99 30.48,6.99 29.21,8.26 26.04,8.26 24.77,9.53 24.77,19.68 26.04,20.95 27.3,20.95 28.57,22.23 U28.5
CLK  (via drill 0.6)
  Top 0.305: U4.19 202.56,46.99 201.29,48.26 174.62,48.26 168.91,53.98 156.21,53.98 154.31,52.07 104.78,52.07 100.97,55.88 99.06,55.88 97.16,57.78 74.3,57.78 72.39,59.69 50.16,59.69 48.9,60.96 | 48.9,60.96 U9.2 | U21.1 31.75,115.57 30.48,114.3 20.95,114.3 20.32,114.94 20.32,117.47 19.68,118.11 15.24,118.11 13.97,116.84 U29.3 | v36.83,111.12 v31.75,111.12 | 48.9,60.96 40.64,60.96 38.1,63.5 v34.29,63.5
  Bottom 0.305: U1.19 202.56,28.57 203.84,29.84 203.84,42.55 202.56,43.81 U4.19 | U2.8 33.66,13.97 34.92,15.24 34.92,19.68 32.38,22.23 32.38,46.35 33.66,47.62 33.66,62.87 v34.29,63.5 34.29,64.14 33.02,65.41 33.02,67.31 34.29,68.58 34.29,96.52 36.2,98.42 36.2,99.69 34.92,100.97 34.92,109.86 36.2,111.12 v36.83,111.12 | v31.75,111.12 U21.1
CLK2
  Bottom 0.305: JP1.25 138.43,127 138.43,124.46 139.06,123.83 148.59,123.83 152.4,120.02 172.72,120.02 177.16,115.57 193.68,115.57 194.94,114.3 U15.25
CS6116  (via drill 0.6)
  Top 0.305: U13.18 135.25,110.49 136.53,109.22 148.59,109.22 149.86,110.49 v149.86,111.76 | JP1.20 144.78,124.46 v146.69,122.56
  Bottom 0.305: v149.86,111.76 149.86,116.84 146.69,120.02 v146.69,122.56
CS6526
  Bottom 0.305: JP1.30 133.35,127 133.35,129.54 133.99,130.18 140.34,130.18 140.97,129.54 140.97,127.64 141.6,127 150.5,127 151.13,126.36 151.13,123.83 153.67,121.28 173.35,121.28 177.8,116.84 198.75,116.84 200.03,115.57 U15.23
D0
  Bottom 0.305: U7.11 147.32,33.02 148.59,31.75 148.59,27.3 153.67,22.23 153.67,8.26 JP2.2
D1
  Bottom 0.305: U7.12 144.78,33.02 146.05,31.75 146.05,27.3 151.13,22.23 151.13,8.26 JP2.4
D2
  Bottom 0.305: JP2.6 148.59,8.26 148.59,22.23 143.51,27.3 143.51,31.75 142.24,33.02 U7.13
D3
  Bottom 0.305: JP2.8 146.05,8.26 146.05,22.23 140.97,27.3 140.97,31.75 139.7,33.02 U7.14
D4
  Bottom 0.305: JP2.10 143.51,8.26 143.51,22.23 138.43,27.3 138.43,31.75 137.16,33.02 U7.15
D5
  Bottom 0.305: JP2.12 140.97,8.26 140.97,22.23 135.89,27.3 135.89,31.75 134.62,33.02 U7.16
D6
  Bottom 0.305: JP2.14 138.43,8.26 138.43,22.23 133.35,27.3 133.35,31.75 132.08,33.02 U7.17
D7
  Bottom 0.305: JP2.16 135.89,8.26 135.89,22.23 130.81,27.3 130.81,31.75 129.54,33.02 U7.18
DRAM-RW  (via drill 0.6)
  Top 0.305: JP2.39 95.89,9.53 93.98,7.62 49.53,7.62 v46.99,10.16 | U25.5 16.51,104.14 17.78,105.41 34.92,105.41 36.2,106.68 v37.47,106.68
  Bottom 0.305: v46.99,10.16 46.99,17.78 38.73,26.04 38.73,40.64 36.83,42.55 36.83,92.71 38.1,93.98 38.1,106.05 v37.47,106.68
GND  (via drill 0.5, 0.6)  (4 unrouted)
  Top 0.305: U3.24 U3.21 132.08,59.69 133.99,57.78 v151.76,57.78 | U13.20 130.18,104.78 125.73,100.33 C17.2 | U1.33 174.62,38.1 173.99,38.73 151.13,38.73 v150.5,38.1 | U9.10 69.22,63.5 67.94,64.77 60.33,64.77 59.05,63.5 | 59.05,63.5 U9.6 | 59.05,63.5 57.78,64.77 v50.16,64.77 | U30.8 95.89,63.5 94.61,64.77 92.08,64.77 90.81,63.5 U30.6 90.81,62.23 89.53,60.96 81.92,60.96 80.64,62.23 U30.2 | U11.15 48.9,34.92 43.81,29.84 C20.2 | U2.13 U2.14 | U2.3 20.95,12.06 | U27.2 20.95,38.73 20.32,39.37 15.88,39.37 C36.2 | U26.2 11.43,65.41 10.16,66.67 1.27,66.67 | U22.12 59.69,111.76 60.96,113.03 62.87,113.03 63.5,112.39 63.5,109.86 64.14,109.22 74.93,109.22 76.83,107.31 C2.2 | U25.14 11.43,111.12 10.16,112.39 7.62,112.39 3.81,116.2 C18.2
  Top 0.406: R1.2 R2.2 1.27,29.21
  Top 1.27: JP1.5 162.56,127 | 162.56,129.54 JP1.5 | 163.83,130.81 162.56,129.54 | 211.46,128.91 209.55,130.81 | 212.09,106.68 212.09,127.64 | 211.46,105.41 212.09,106.68 | 210.82,104.78 211.46,105.41 | C15.2 210.82,104.78 | 210.82,103.5 211.46,102.87 | C15.2 210.82,103.5 | 211.46,102.87 212.09,101.6 | 212.09,101.6 212.09,80.01 | 212.09,80.01 211.46,78.74 | 211.46,78.74 C16.2 | 211.46,78.74 212.09,77.47 | 212.09,77.47 212.09,46.99 | 212.09,46.99 211.46,45.72 | 211.46,45.72 C4.2 U4.20 | 211.46,45.72 212.09,44.45 | 212.09,44.45 212.09,22.86 | 212.09,22.86 211.46,21.59 | 211.46,21.59 C30.2 U1.20 | 211.46,21.59 212.09,20.32 | 156.21,132.08 157.48,130.81 | 157.48,129.54 JP1.9 | JP1.9 157.48,127 | 157.48,127 JP1.10 JP1.6 162.56,127 | 157.48,127 162.56,127 | JP1.5 JP1.9 | 190.5,132.08 212.09,132.08 212.09,127.64 | 190.5,132.08 156.21,132.08 | 212.09,127.64 211.46,128.91 | 211.46,128.91 211.46,131.44 210.82,130.81 209.55,130.81 | 209.55,130.81 190.5,130.81 | 190.5,130.81 163.83,130.81 | 163.83,130.81 157.48,130.81 | 157.48,130.81 157.48,129.54 | 157.48,129.54 162.56,129.54 | 156.21,132.08 1.27,132.08 1.27,66.67 1.27,45.72 | 1.27,45.72 1.27,29.21 1.27,1.27 129.54,1.27 | 211.46,102.87 211.46,105.41 | 212.09,106.68 212.09,101.6 | 212.09,80.01 212.09,77.47 | 212.09,46.99 212.09,44.45 | 212.09,22.86 212.09,20.32 | 212.09,20.32 212.09,1.27 132.08,1.27 | 132.08,1.27 130.81,1.27 | 130.81,1.27 129.54,1.27 | C13.2 153.03,102.87 186.69,102.87 188.59,104.78 209.55,104.78 | 209.55,104.78 C15.2 | 209.55,103.5 188.59,103.5 186.69,101.6 153.03,101.6 C13.2 | 209.55,104.78 210.82,104.78 | 210.82,104.78 210.82,103.5 | 209.55,103.5 210.82,103.5 | 209.55,103.5 C15.2 | v152.4,96.52 U15.1
  Top 1.27: C13.2 147.96,97.79 U13.12 | C1.2 U7.10 | C14.2 U14.14 | U3.14 v152.4,45.72 U4.1 | C7.2 v109.22,29.21 U6.10 | C8.2 U5.10 | U6.1 C29.2 C37.- U11.8 | U5.1 C19.2 U12.8 | v109.22,62.87 U30.8 | U27.7 41.91,29.21 C20.2 | U18.7 36.2,51.44 C21.2 | U19.7 71.75,116.2 73.03,114.94 v74.93,114.94 | C23.2 U17.8 | 1.27,45.72 JP4.1 | 190.5,132.08 190.5,130.81 | 190.5,130.81 190.5,125.09 | 156.21,81.92 v152.4,81.92 156.84,81.92 158.12,80.64 186.69,80.64 189.87,83.82 IC1.7 | 129.54,1.27 JP2.20 JP2.19 130.81,9.53 | 132.08,1.27 JP2.18 JP2.17 130.81,9.53 | 130.81,1.27 130.81,9.53
  Bottom 0.305: v50.16,64.77 50.16,55.24 48.9,53.98 U12.15 | U30.6 U30.11 | U30.2 U30.15 | U2.7 31.11,11.43 28.57,13.97 U2.13
  Bottom 1.27: JP1.9 157.48,127 | 157.48,127 JP1.10 JP1.8 | JP1.8 JP1.6 162.56,127 | JP1.5 162.56,127 | JP1.5 161.29,128.27 | JP1.7 161.29,128.27 | JP1.9 JP1.7 | JP1.7 JP1.8 | 157.48,127 162.56,127 | 160.02,129.54 JP1.7 | 160.02,130.81 160.02,129.54 | 160.02,132.08 160.02,130.81 | 212.09,20.32 212.09,1.27 75.56,1.27 | 212.09,22.86 212.09,20.32 | 212.09,44.45 212.09,22.86 | 212.09,45.72 212.09,44.45 | 212.09,46.99 212.09,45.72 | 212.09,77.47 212.09,46.99 | 212.09,101.6 212.09,80.01 | 212.09,102.87 212.09,101.6 | 212.09,104.14 212.09,102.87 | 212.09,104.14 212.09,105.41 | 212.09,105.41 212.09,106.68 | 210.82,129.54 210.82,130.81 209.55,130.81 | 163.83,130.81 162.56,130.81 | 162.56,130.81 161.29,130.81 | 160.02,130.81 161.29,130.81 | 162.56,130.81 162.56,129.54 | JP1.5 162.56,129.54 | 161.29,130.81 161.29,128.27 | JP1.9 157.48,129.54 | 160.02,129.54 157.48,129.54 | 160.02,130.81 157.48,130.81 | 157.48,130.81 157.48,129.54 | 157.48,132.08 157.48,130.81 | 160.02,132.08 157.48,132.08 | 75.56,1.27 38.1,1.27 | 38.1,1.27 31.11,1.27 | 31.11,1.27 20.95,1.27 | 20.95,1.27 15.88,1.27 | 15.88,1.27 8.26,1.27 | 8.26,1.27 1.27,1.27 1.27,33.02 | 1.27,116.2 1.27,132.08 26.04,132.08 | 1.27,116.2 1.27,89.53 | 1.27,89.53 1.27,76.83 | 1.27,76.83 1.27,64.14 | 1.27,64.14 1.27,51.44 | 1.27,33.02 1.27,37.47 | 1.27,51.44 1.27,37.47 | 156.21,132.08 90.81,132.08 | 90.81,132.08 74.93,132.08 | 74.93,132.08 48.9,132.08 | 48.9,132.08 26.04,132.08 | 157.48,132.08 156.21,132.08 | 212.09,45.72 211.46,45.72 | C4.2 211.46,45.72 | 209.55,130.81 190.5,130.81 | 190.5,130.81 163.83,130.81 | 210.82,129.54 209.55,130.81 | 163.83,130.81 162.56,129.54 | 157.48,130.81 156.21,132.08 | 211.46,104.14 212.09,104.14 | 211.46,104.14 212.09,105.41
  Bottom 1.27: 211.46,104.14 212.09,102.87 | C16.2 211.46,78.74 | 212.09,80.01 211.46,78.74 | 212.09,80.01 212.09,77.47 | 211.46,78.74 212.09,77.47 | 212.09,46.99 211.46,45.72 | 211.46,45.72 212.09,44.45 | C30.2 211.46,21.59 | 212.09,22.86 211.46,21.59 | 212.09,20.32 211.46,21.59 | 212.09,106.68 210.82,104.78 | 212.09,101.6 210.82,103.5 | 211.46,132.08 190.5,132.08 | 190.5,132.08 160.02,132.08 | 211.46,132.08 212.09,132.08 212.09,127.64 | 212.09,106.68 212.09,127.64 | C15.2 211.46,104.14 | 211.46,128.91 210.82,129.54 | 212.09,127.64 211.46,128.91 | 211.46,128.91 211.46,132.08 | C13.2 v152.4,96.52 v152.4,81.92 150.5,80.01 150.5,72.39 151.76,71.12 C14.2 152.4,66.67 150.5,64.77 150.5,59.05 v151.76,57.78 152.4,57.15 C3.2 v152.4,45.72 152.4,39.37 v150.5,38.1 150.5,33.02 152.4,31.11 C1.2 152.4,27.94 156.84,23.5 U1.1 | JP2.25 121.92,21.59 118.11,24.13 C7.2 | U30.8 97.79,62.87 97.79,75.56 | 97.79,75.56 97.79,85.09 | 97.79,85.09 97.79,87 | 97.79,75.56 U8.10 | 74.93,88.27 73.66,88.27 69.22,83.82 69.22,80.64 | 69.22,80.64 69.22,73.66 71.12,71.75 71.12,69.22 71.75,68.58 71.75,62.87 U9.10 69.22,45.72 C19.2 71.75,38.73 73.03,37.47 73.03,29.21 C29.2 75.56,1.27 | 69.22,80.64 C23.2 | 97.79,85.09 C10.2 | v109.22,29.21 C8.2 109.22,49.53 107.31,51.44 107.31,55.24 109.22,57.15 v109.22,62.87 C9.2 109.22,84.45 107.31,84.45 107.31,88.27 109.22,88.27 C17.2 107.31,100.33 107.31,117.47 105.41,119.38 92.71,119.38 90.81,121.28 90.81,132.08 | C20.2 41.91,29.21 C21.2 40.01,45.72 40.01,62.87 | JP2.31 JP2.29 JP2.27 JP2.25 | JP2.19 JP2.21 JP2.23 JP2.25 | JP2.19 130.81,9.53 | 130.81,6.99 JP2.18 JP2.17 130.81,9.53 | JP2.19 JP2.20 130.81,6.99
  Bottom 1.27: 1.27,33.02 C12.2 | 8.26,1.27 8.26,9.53 | 15.88,1.27 U2.1 | 20.95,1.27 U2.3 | 31.11,1.27 U2.7 | 38.1,10.79 U2.9 JP5.1 | 1.27,51.44 C11.2 | U27.7 35.56,37.47 35.56,23.5 | U20.7 97.79,106.68 97.79,87 | 97.79,87 U10.7 | 74.93,88.27 C6.2 | 74.93,132.08 v74.93,114.94 74.93,106.68 | 40.01,62.87 40.01,72.39 41.91,72.39 C24.2 40.01,80.64 40.01,90.17 44.45,90.17 44.45,103.5 48.9,103.5 | 40.01,62.87 C22.2 | 26.04,64.14 26.04,51.44 U18.7 | 1.27,64.14 C25.2 | 1.27,76.83 C26.2 | 26.04,76.83 26.04,64.14 | 26.04,64.14 U26.7 27.94,64.14 C35.- | 1.27,89.53 C27.2 | 26.04,89.53 26.04,86.36 | 26.04,86.36 26.04,76.83 | 26.04,76.83 U24.7 | 26.04,102.87 26.04,89.53 | 26.04,89.53 U23.7 | 1.27,116.2 C18.2 | 26.04,116.2 26.04,102.87 | 26.04,102.87 U25.8 C5.2 | 26.04,132.08 26.04,116.2 | 26.04,116.2 U29.7 C33.2 | 48.9,132.08 48.9,116.2 | 48.9,116.2 48.9,103.5 | 48.9,116.2 U21.7 | 48.9,116.2 C28.2 | 74.93,106.68 C2.2 | 74.93,106.68 74.93,103.5 | 74.93,103.5 74.93,88.27 | 74.93,103.5 U22.7 | 48.9,103.5 C32.2 | 35.56,23.5 U28.7 | 35.56,23.5 35.56,21.59 38.1,21.59 38.1,10.79 | 38.1,1.27 38.1,10.79 | 190.5,130.81 190.5,125.09 | 190.5,132.08 190.5,130.81 | 26.04,86.36 C34.- | 1.27,37.47 C36.2 | 130.81,6.99 130.81,9.53
I/O  (via drill 0.6)
  Top 0.305: U17.5 U17.4 | U10.12 85.72,93.34 83.82,91.44 76.2,91.44 73.03,94.61 v62.87,94.61 59.69,94.61 57.78,92.71 41.91,92.71 40.01,94.61 v36.83,94.61 | U18.8 v35.56,59.05
  Bottom 0.305: U17.5 56.52,83.19 60.33,87 60.33,90.81 62.87,93.34 v62.87,94.61 | v35.56,59.05 36.2,59.69 36.2,93.98 v36.83,94.61
IRQ
  Bottom 0.305: JP1.12 154.94,125.09 156.21,123.83 174.62,123.83 179.07,119.38 203.84,119.38 205.1,118.11 U15.21 205.1,110.49
MRDC  (via drill 0.6)
  Top 0.305: U18.12 13.97,58.42 15.88,56.52 25.4,56.52 26.04,55.88 36.83,55.88 41.27,51.44 v60.33,51.44 | v87,99.06 86.36,98.42 74.93,98.42 74.3,97.79 70.48,97.79 69.85,98.42 54.61,98.42 52.7,96.52 50.8,96.52 v50.16,97.16
  Bottom 0.305: 54.61,73.03 RN3.5 | 54.61,73.03 55.24,72.39 55.24,69.22 57.78,66.67 59.69,66.67 61.59,64.77 U9.7 61.59,57.15 60.33,55.88 v60.33,51.44 | 54.61,73.03 51.44,73.03 50.8,73.66 50.8,78.11 50.16,78.74 v50.16,97.16 | U20.11 88.27,111.12 87,109.86 v87,99.06
N$1
  Bottom 0.305: U4.23 200.03,53.98 198.75,52.7 198.75,43.81 200.03,42.55 U1.23 200.03,29.84 201.29,28.57 201.29,20.32 200.66,19.68 199.39,19.68 198.12,18.41 198.12,14.61 200.03,12.7 RN1.2
N$2  (via drill 0.6)
  Top 0.305: U14.20 134.62,87.63 133.35,88.9 130.81,88.9 129.54,87.63 | 129.54,87.63 U14.22 | 129.54,87.63 125.73,90.81 115.57,90.81 114.3,92.08 104.14,92.08 96.52,99.69 95.25,99.69 92.08,102.87 74.3,102.87 71.75,105.41 v71.75,106.05
  Bottom 0.305: U19.8 73.66,120.02 73.66,107.95 v71.75,106.05
N$3
  Bottom 0.305: RN2.10 179.71,92.08 178.44,90.81 178.44,80.64 170.81,73.03 170.81,63.5 172.09,62.23 U4.34
N$4
  Top 0.305: U1.22 202.56,31.11 198.75,27.3 198.75,20.32 196.22,17.78 187.32,17.78 182.25,12.7 167.64,12.7 161.29,19.05 154.94,19.05 152.4,21.59 125.73,21.59 124.46,22.86 119.38,22.86 118.75,23.5 104.78,23.5 104.14,22.86 95.89,22.86 95.25,23.5 76.2,23.5 74.93,22.23 53.34,22.23 46.99,15.88 29.84,15.88 26.04,12.06 U2.5
  Bottom 0.305: U1.22 202.56,42.55 201.29,43.81 201.29,52.7 202.56,53.98 U4.22
N$5
  Bottom 0.305: U4.25 194.94,53.98 193.68,52.7 193.68,43.81 194.94,42.55 U1.25
N$6
  Bottom 0.305: U1.24 197.49,42.55 196.22,43.81 196.22,52.7 197.49,53.98 U4.24
N$7  (via drill 0.6)
  Top 0.305: U4.33 169.54,66.04 143.51,66.04 142.24,67.31 128.27,67.31 127.64,66.67 v121.92,66.67 | v123.19,89.53 121.92,89.53 120.65,90.17 114.94,90.17 113.67,91.44 103.5,91.44 95.89,99.06 94.61,99.06 92.08,101.6 v85.09,101.6 84.45,102.23 71.12,102.23 70.48,101.6 48.26,101.6 46.99,102.87 46.99,107.95 45.72,109.22 34.92,109.22 33.66,107.95 15.24,107.95 13.97,109.22 U25.13
  Bottom 0.305: U4.33 174.62,53.98 173.35,52.7 173.35,19.68 JP3.2 170.81,12.7 173.35,10.16 RN1.10 | v121.92,66.67 121.92,68.58 123.19,69.85 v123.19,89.53 | v85.09,101.6 85.72,102.23 U20.3
N$8  (1 unrouted)
  Top 0.406: U2.17 18.41,17.14 17.14,15.88 14.61,15.88 10.79,19.68 R1.1
N$9  (via drill 0.6)
  Top 0.305: v114.3,42.55 122.56,42.55 127,38.1 U7.19 | v113.03,90.17 99.06,90.17 95.89,93.34 U10.8
  Bottom 0.305: v114.3,42.55 112.39,44.45 112.39,89.53 v113.03,90.17
N$10
  Bottom 0.305: U4.31 179.71,53.98 178.44,52.7 178.44,43.81 179.71,42.55 U1.31 179.71,29.84 178.44,28.57 178.44,20.32 177.8,19.68 175.9,19.68 JP3.1
N$11  (via drill 0.6)
  Top 0.305: v187.32,54.61 172.09,54.61 170.81,55.88 120.65,55.88 119.38,57.15 105.41,57.15 102.87,59.69 77.47,59.69 70.48,66.04 54.61,66.04 51.44,69.22 U9.18
  Bottom 0.305: U4.28 v187.32,54.61 187.32,53.98 186.06,52.7 186.06,43.81 187.32,42.55 U1.28 187.32,29.84 186.06,28.57 186.06,19.05 187.32,17.78 RN1.7
N$12  (via drill 0.5, 0.6)
  Top 0.305: v147.32,80.64 146.05,81.92 130.81,81.92 128.27,84.45 128.27,87.63 127.64,88.27 121.28,88.27 120.02,89.53 114.94,89.53 113.67,88.9 106.68,88.9 106.05,89.53 97.16,89.53 93.34,93.34 U10.9 | v156.21,41.27 v146.69,41.27
  Bottom 0.305: v147.32,80.64 147.32,78.74 148.59,77.47 148.59,69.85 144.78,66.04 U3.16 144.78,54.61 146.05,53.34 146.05,41.91 v146.69,41.27 | RN1.9 180.34,8.26 163.83,8.26 158.12,15.24 158.12,24.77 155.57,27.3 155.57,40.64 v156.21,41.27
N$13
  Top 0.305: RN1.8 184.78,11.43 184.15,12.06 166.37,12.06 160.02,18.41 154.31,18.41 151.76,20.95 89.53,20.95 87.63,22.86 76.83,22.86 75.56,21.59 54.61,21.59 47.62,14.61 31.11,14.61 28.57,12.06 U2.6
  Bottom 0.305: U2.15 U2.4 23.5,10.16 24.77,8.89 27.3,8.89 28.57,10.16 U2.6
N$14  (1 unrouted)
  Top 0.406: U2.16 20.95,17.14 18.41,14.61 9.53,14.61 5.71,18.41 R2.1
N$15  (via drill 0.6)
  Top 0.305: v60.33,93.34 73.03,93.34 75.56,90.81 88.27,90.81 90.81,93.34 U10.10
  Bottom 0.305: U9.16 56.52,73.03 55.88,73.66 55.88,78.11 55.24,78.74 55.24,83.82 57.78,86.36 57.78,90.81 v60.33,93.34
N$16  (via drill 0.6)
  Top 0.305: v140.97,69.22 142.88,69.22 143.51,68.58 v145.41,68.58 | v146.69,89.53 144.15,91.44 116.2,91.44 114.94,92.71 104.78,92.71 95.89,101.6 v95.25,101.6 | U21.11 39.37,125.73 40.64,127 72.39,127 73.66,125.73 73.66,118.75 74.93,117.47 94.61,117.47 95.89,116.2 U20.8
  Bottom 0.305: U3.18 139.7,67.94 v140.97,69.22 | v145.41,68.58 146.05,69.22 146.05,81.28 149.22,84.45 149.22,87.63 147.32,89.53 v146.69,89.53 | U20.8 95.89,111.12 94.61,109.86 94.61,105.41 95.25,104.14 v95.25,101.6
N$17  (via drill 0.5)
  Top 0.305: IC1.6 192.41,87.63 190.5,89.53 182.25,89.53 180.97,88.27 180.97,84.45 180.34,83.82 161.93,83.82 161.29,84.45 156.21,84.45 153.67,87 153.67,91.44 152.4,92.71 117.47,92.71 116.2,93.98 106.05,93.98 95.89,104.14 75.56,104.14 74.3,105.41 74.3,106.68 73.03,107.95 62.23,107.95 61.59,108.58 v60.96,108.58
  Bottom 0.305: U17.14 51.44,90.17 53.98,92.71 57.78,92.71 60.96,95.89 v60.96,108.58
N$18
  Bottom 0.305: IC1.18 161.93,90.81 163.19,92.08 163.19,97.79 162.56,98.42 160.02,98.42 159.38,97.79 U15.2
N$19
  Top 0.305: U20.10 90.81,114.94 89.53,116.2 73.66,116.2 72.39,117.47 72.39,124.46 71.12,125.73 66.04,125.73 64.77,124.46 U19.10
N$20  (via drill 0.6)
  Top 0.305: U3.26 119.38,59.69 118.11,58.42 106.05,58.42 104.14,60.33 78.11,60.33 71.12,67.31 v61.59,67.31
  Bottom 0.305: v61.59,67.31 U9.14 RN3.6
N$21  (via drill 0.6)
  Top 0.305: U3.19 137.16,59.69 137.79,59.05 148.59,59.05 149.22,59.69 154.94,59.69 156.21,58.42 175.26,58.42 175.9,57.78 v177.16,57.78
  Bottom 0.305: v177.16,57.78 U4.32
N$22  (via drill 0.6)
  Top 0.305: v115.57,88.27 103.5,88.27 102.87,88.9 91.44,88.9 90.17,90.17 74.93,90.17 73.03,92.08 50.16,92.08 48.9,90.81 U17.15
  Bottom 0.305: U3.1 114.3,57.78 113.03,59.05 113.03,81.28 115.57,83.82 v115.57,88.27
N$23  (via drill 0.6)
  Top 0.305: v124.46,26.04 124.46,25.4 123.83,24.77 121.28,24.77 120.65,25.4 104.14,25.4 102.87,24.13 98.42,24.13 97.79,24.77 74.93,24.77 73.66,23.5 69.22,23.5 67.94,24.77 v62.87,24.77
  Bottom 0.305: U9.4 53.98,56.52 55.24,55.24 57.15,55.24 57.78,54.61 57.78,50.16 60.33,47.62 60.33,33.66 62.87,31.11 v62.87,24.77 | v124.46,26.04 U7.1
N$24  (via drill 0.6)
  Top 0.305: v93.34,97.16 92.71,96.52 85.09,96.52 84.45,95.89 84.45,93.34 83.19,92.08 76.83,92.08 73.66,95.25 67.94,95.25 67.31,95.89 57.15,95.89 55.24,93.98 46.99,93.98 45.09,95.89 42.55,95.89 39.37,99.06 v34.92,99.06
  Bottom 0.305: U28.4 26.04,26.04 28.57,28.57 U28.10 28.57,33.02 29.84,34.29 29.84,40.64 28.57,41.91 U27.10 28.57,45.72 29.84,46.99 31.75,46.99 32.38,47.62 32.38,67.94 33.66,69.22 33.66,97.79 v34.92,99.06 | v93.34,97.16 U20.6
N$25  (via drill 0.6)
  Top 0.305: U8.1 73.03,74.93 71.12,73.03 v65.41,73.03 | U25.1 6.35,103.5 8.89,106.05 34.29,106.05 36.2,107.95 44.45,107.95 45.72,106.68 45.72,101.6 46.99,100.33 v72.39,100.33
  Bottom 0.305: v65.41,73.03 64.77,73.03 63.5,74.3 63.5,78.11 62.87,78.74 62.87,90.81 68.58,96.52 68.58,99.06 69.85,100.33 | v72.39,100.33 69.85,100.33 | 69.85,100.33 68.58,101.6 68.58,114.3 67.31,115.57 U19.6
N$26
  Top 0.305: U24.10 19.05,85.72 17.78,87 13.34,87 12.7,87.63 12.7,99.06 12.06,99.69 R5.2 U25.3
N$27
  Top 0.305: U10.13 83.19,93.34 82.55,92.71 77.47,92.71 74.3,95.89 68.58,95.89 67.94,96.52 56.52,96.52 54.61,94.61 47.62,94.61 45.72,96.52 43.18,96.52 39.37,100.33 24.13,100.33 22.86,99.06 22.86,87 24.13,85.72 U24.8
N$28  (via drill 0.6)
  Top 0.305: U19.9 67.31,122.56 66.67,121.92 46.35,121.92 45.72,122.56 45.72,125.09 45.09,125.73 43.81,125.73 43.18,125.09 43.18,120.65 44.45,119.38 U21.6 | v46.99,113.03 42.55,113.03 41.91,113.67 32.38,113.67 31.75,113.03 19.68,113.03 18.41,114.3 17.14,114.3 16.51,113.67 v11.43,113.67
  Bottom 0.305: U25.2 8.89,105.41 10.16,106.68 10.16,112.39 v11.43,113.67 | v46.99,113.03 44.45,115.57 U21.6
N$29
  Bottom 0.305: U15.24 197.49,104.78 198.75,103.5 198.75,99.06 | 198.75,99.06 198.75,95.25 200.03,93.98 RN2.2 | IC1.15 169.54,90.17 170.81,91.44 170.81,97.79 172.09,99.06 198.75,99.06
N$30
  Top 0.305: U15.16 194.94,98.42 193.68,99.69 152.4,99.69 149.86,97.16 149.86,95.25 149.22,94.61 119.38,94.61 118.11,95.89 107.95,95.89 99.69,104.14 99.69,107.95 96.52,111.12 94.61,111.12 93.34,112.39 U20.9
  Bottom 0.305: RN2.4 U15.16
N$31
  Bottom 0.305: U15.3 161.93,92.71 159.38,90.17 IC1.19
N$32
  Bottom 0.305: U15.4 164.47,92.08 163.19,90.81 163.19,85.09 162.56,84.45 158.12,84.45 156.84,85.72 IC1.20
N$33
  Bottom 0.305: U15.5 167,91.44 165.74,90.17 165.74,83.19 156.84,74.3 IC1.21
N$34
  Bottom 0.305: IC1.22 159.38,74.3 168.28,83.19 168.28,90.17 169.54,91.44 U15.6
N$35
  Bottom 0.305: U15.7 172.09,91.44 170.81,90.17 170.81,83.19 161.93,74.3 IC1.23
N$36
  Bottom 0.305: IC1.24 164.47,74.3 173.35,83.19 173.35,90.17 174.62,91.44 U15.8
N$37
  Bottom 0.305: U15.9 177.16,91.44 175.9,90.17 175.9,83.19 167,74.3 IC1.25
N$39